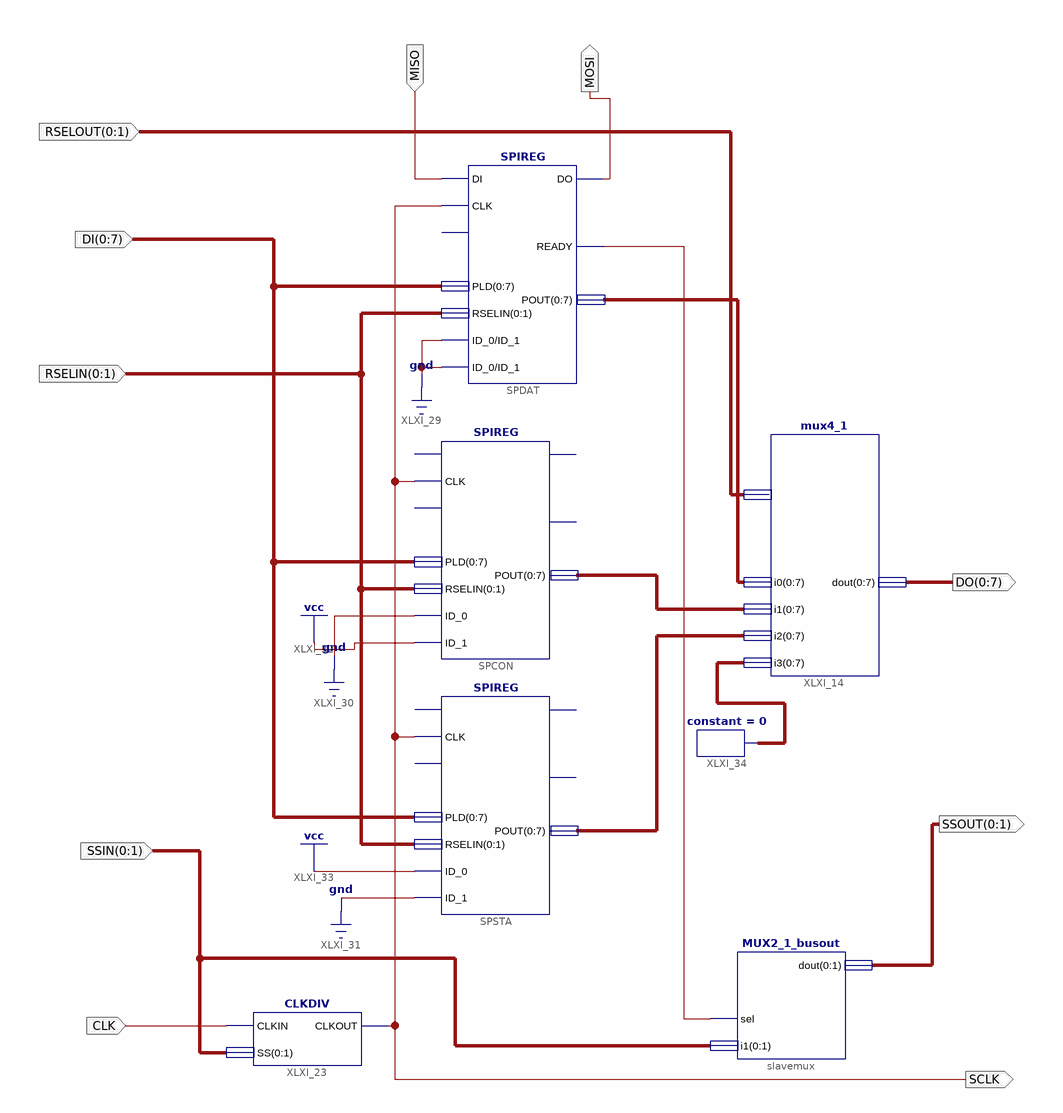
[diagram p0: schematic sheet 1]
// Xilinx ISE schematic SPYMASTER.sch (spartan3e) as structural Verilog: 7 symbols, 10 ports
module SPYMASTER (
  input  [0:1] RSELIN,
  input  CLK,
  input  [0:7] DI,
  input  MISO,
  input  [0:1] RSELOUT,
  input  [0:1] SSIN,
  output [0:7] DO,
  output [0:1] SSOUT,
  output MOSI,
  output SCLK
);

  wire XLXN_172;
  wire [7:0] XLXN_86, XLXN_149, XLXN_150, XLXN_174;

  mux4_1 XLXI_14 (
    .i0({XLXN_86[0], XLXN_86[1], XLXN_86[2], XLXN_86[3], XLXN_86[4], XLXN_86[5], XLXN_86[6], XLXN_86[7]}),
    .i1({XLXN_149[0], XLXN_149[1], XLXN_149[2], XLXN_149[3], XLXN_149[4], XLXN_149[5], XLXN_149[6], XLXN_149[7]}),
    .i2({XLXN_150[0], XLXN_150[1], XLXN_150[2], XLXN_150[3], XLXN_150[4], XLXN_150[5], XLXN_150[6], XLXN_150[7]}),
    .i3({XLXN_174[0], XLXN_174[1], XLXN_174[2], XLXN_174[3], XLXN_174[4], XLXN_174[5], XLXN_174[6], XLXN_174[7]}),
    .dout(DO), .sel(RSELOUT));
  SPIREG #(.VeriModel("SPIREG")) SPDAT (
    .CLK(SCLK), .DI(MISO), .ID_0(1'b0), .ID_1(1'b0), .PLD(DI), .RSELIN(RSELIN), .DO(MOSI), .READY(XLXN_172),
    .POUT({XLXN_86[0], XLXN_86[1], XLXN_86[2], XLXN_86[3], XLXN_86[4], XLXN_86[5], XLXN_86[6], XLXN_86[7]}));  // open: EN
  SPIREG SPCON (
    .CLK(SCLK), .ID_0(1'b0), .ID_1(1'b1), .PLD(DI), .RSELIN(RSELIN),
    .POUT({XLXN_149[0], XLXN_149[1], XLXN_149[2], XLXN_149[3], XLXN_149[4], XLXN_149[5], XLXN_149[6], XLXN_149[7]}));  // open: DI, EN, DO, READY
  SPIREG SPSTA (
    .CLK(SCLK), .ID_0(1'b1), .ID_1(1'b0), .PLD(DI), .RSELIN(RSELIN),
    .POUT({XLXN_150[0], XLXN_150[1], XLXN_150[2], XLXN_150[3], XLXN_150[4], XLXN_150[5], XLXN_150[6], XLXN_150[7]}));  // open: DI, EN, DO, READY
  CLKDIV XLXI_23 (.CLKIN(CLK), .SS(SSIN), .CLKOUT(SCLK));
  MUX2_1_busout slavemux (.sel(XLXN_172), .i1(SSIN), .dout(SSOUT));
  constant #(.CValue("0")) XLXI_34 (.O({XLXN_174[0], XLXN_174[1], XLXN_174[2], XLXN_174[3], XLXN_174[4], XLXN_174[5], XLXN_174[6], XLXN_174[7]}));
endmodule
